# Altium project HECA.PrjPcb
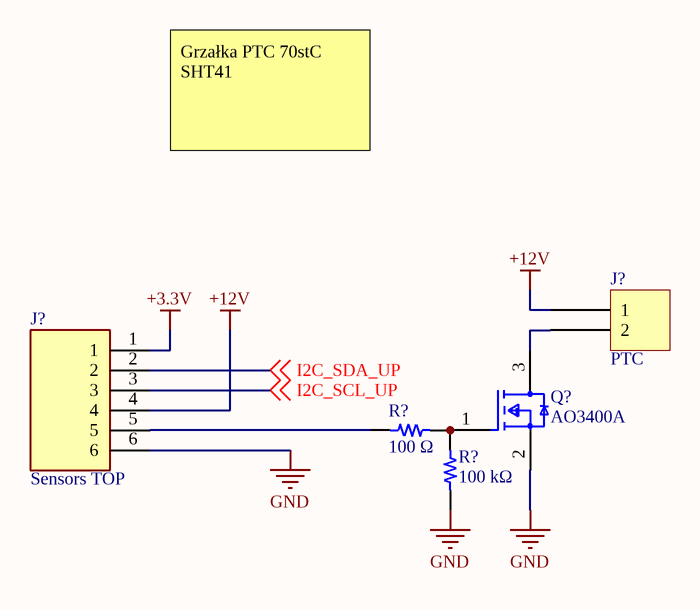
[diagram p0: HECA.SchDoc]
1 sheet, 5 parts. Net scope: global (net labels, ports and power ports of the same name join across sheets).

## Sheet HECA.SchDoc
size A4; SheetNumber: 1; SheetTotal: 1

### Parts
(Parts that share a designator on the sheet are numbered #1, #2 ... from top to bottom, then left to right.)
J?#1  PTC  [AVX 9296002202806]
J?#2  Sensors TOP  [SHDR6W50P0X150_1X6_1050X350X450P]
Q?  AO3400A  [FP-SOT23-MFG]
R?#1  100 Ω  [RES 0603_1608]
R?#2  100 kΩ  [RES 0603_1608]

### Nets
+3.3V: J?#2.1
+12V: J?#1.1 J?#2.4
GND: J?#2.6 Q?.2(S) R?#2.1
I2C_SCL_UP: J?#2.3 ; off-sheet I2C_SCL_UP
I2C_SDA_UP: J?#2.2 ; off-sheet I2C_SDA_UP
NetJ?#1_2: J?#1.2 Q?.3(D)
NetJ?#2_5: J?#2.5 R?#1.1
NetQ?_1: Q?.1(G) R?#1.2 R?#2.2

### Notes on the sheet
- Grzałka PTC 70stC
  SHT41

### Library data of the parts
J?#1 = 009296002202906: CONN WIRE POKE-IN 2POS SMD RA; Manufacturer: AVX Corporation; Board-Side Pitch: 0.118" (3.00mm); Connector Type: Individual Wires; Number of Positions: 2; Wire Gauge: 20-26 AWG; Part Number: 009296002202906; Cable Pitch: 0.118" (3.00mm); Cable Termination: Poke-In; Color: White; ComponentLink1Description: Datasheet; ComponentLink1URL: http://datasheets.avx.com/PHLPHorizontal_00-9296.pdf; ComponentLink2Description: DigiKey Link; ComponentLink2URL: http://digikey.com/product-detail/en/avx-corporation/009296002202906/478-9533-1-ND/5161727; Contact Finish: Tin; Features: Closed End; LastUpdated: 1.05.2020 07:29:21; Lifecycle Status: Active; Minimum Order: 1; Mounting Type: Surface Mount, Right Angle; Number of Rows: 1; Packaging: TapeAndReel; Part Status: Active; Price: 0.23; Series: 9296; Supplier 1: DigiKey; Supplier Part Number 1: 478-9533-1-ND
J?#2 = B6B-ZR: CONN HEADER ZH TOP 6POS 1.5MM; Manufacturer_Name: JST (JAPAN SOLDERLESS TERMINALS); Geometry.Height: 4.5mm; Manufacturer_Part_Number: B6B-ZR; Mouser Part Number: N/A; Mouser Price/Stock: https://www.mouser.co.uk/ProductDetail/JST/B6B-ZR?qs=BJlw7L4Cy7%2FnnkhPIMLEpQ%3D%3D; Arrow Part Number: *; Arrow Price/Stock: *; Datasheet Link: http://www.jst-mfg.com/product/pdf/eng/eZH.pdf
Q? = CMP-83955-000006-1: MOSFET N-CH 30V 5.7A SOT23; Input Capacitance: 630pF; Number of Elements: 1; Rds On Max: 26.5mR; Max Power Dissipation: 1.4W; Gate to Source Voltage (Vgs): 12V; Min Operating Temperature: -55°C; Lead Free: Lead Free; Number of Pins: 3; Drain to Source Voltage (Vdss): 30V; Case/Package: SOT-23; Mount: Surface Mount; Continuous Drain Current (ID): 5.7A; Radiation Hardening: No; Packaging: Tape and Reel; Max Operating Temperature: 150°C; Power Dissipation: 1.4W
R?#1 = CRCW0603100RFKEA: RES SMD 100 OHM 1% 1/10W 0603; Manufacturer: Vishay Dale; Power (Watts): 0.1W, 1/10W; Temperature Coefficient: ±100ppm/°C; Part Number: CRCW0603100RFKEA; Value: 100 Ω; ComponentLink1Description: Datasheet; ComponentLink1URL: http://www.vishay.com/docs/20035/dcrcwe3.pdf; ComponentLink2Description: DigiKey Link; ComponentLink2URL: https://www.digikey.com/en/products/detail/vishay-dale/CRCW0603100RFKEA/1174554; Composition: Thick Film; Device Package: 0603 (1608 Metric); Features: Automotive AEC-Q200; Height - Seated (Max): 0.020" (0.50mm); LastUpdated: 9.02.2024 20:42:10; Lifecycle Status: Active; Minimum Order: 1; Number of Terminations: 2; Operating Temperature: -55°C ~ 155°C; Package / Case: 0603 (1608 Metric); Packaging: CutTape; PartId: 24638; Part Status: Active; Price: 0.01; Ratings: AEC-Q200; Resistance: 100 Ω; Series: CRCW; Size / Dimension: 0.061" L x 0.033" W (1.55mm x 0.85mm); Supplier 1: DigiKey; Supplier Part Number 1: 541-100HCT-ND; Supplier Device Package: 0603; Tolerance: ±1%
R?#2 = CRCW0603100KFKEA: RES SMD 100K OHM 1% 1/10W 0603; Manufacturer: Vishay Dale; Power (Watts): 0.1W, 1/10W; Temperature Coefficient: ±100ppm/°C; Part Number: CRCW0603100KFKEA; Value: 100 kΩ; ComponentLink1Description: Datasheet; ComponentLink1URL: http://www.vishay.com/docs/20035/dcrcwe3.pdf; ComponentLink2Description: DigiKey Link; ComponentLink2URL: https://www.digikey.com/en/products/detail/vishay-dale/CRCW0603100KFKEA/1174896; Composition: Thick Film; Device Package: 0603 (1608 Metric); Features: Automotive AEC-Q200; Height - Seated (Max): 0.020" (0.50mm); LastUpdated: 9.02.2024 20:42:10; Lifecycle Status: Active; Minimum Order: 1; Number of Terminations: 2; Operating Temperature: -55°C ~ 155°C; Package / Case: 0603 (1608 Metric); Packaging: CutTape; PartId: 24639; Part Status: Active; Price: 0.01; Ratings: AEC-Q200; Resistance: 100 kΩ; Series: CRCW; Size / Dimension: 0.061" L x 0.033" W (1.55mm x 0.85mm); Supplier 1: DigiKey; Supplier Part Number 1: 541-100KHCT-ND; Supplier Device Package: 0603; Tolerance: ±1%